# EAGLE schematic CC2530EV (EAGLE 7.1.0)
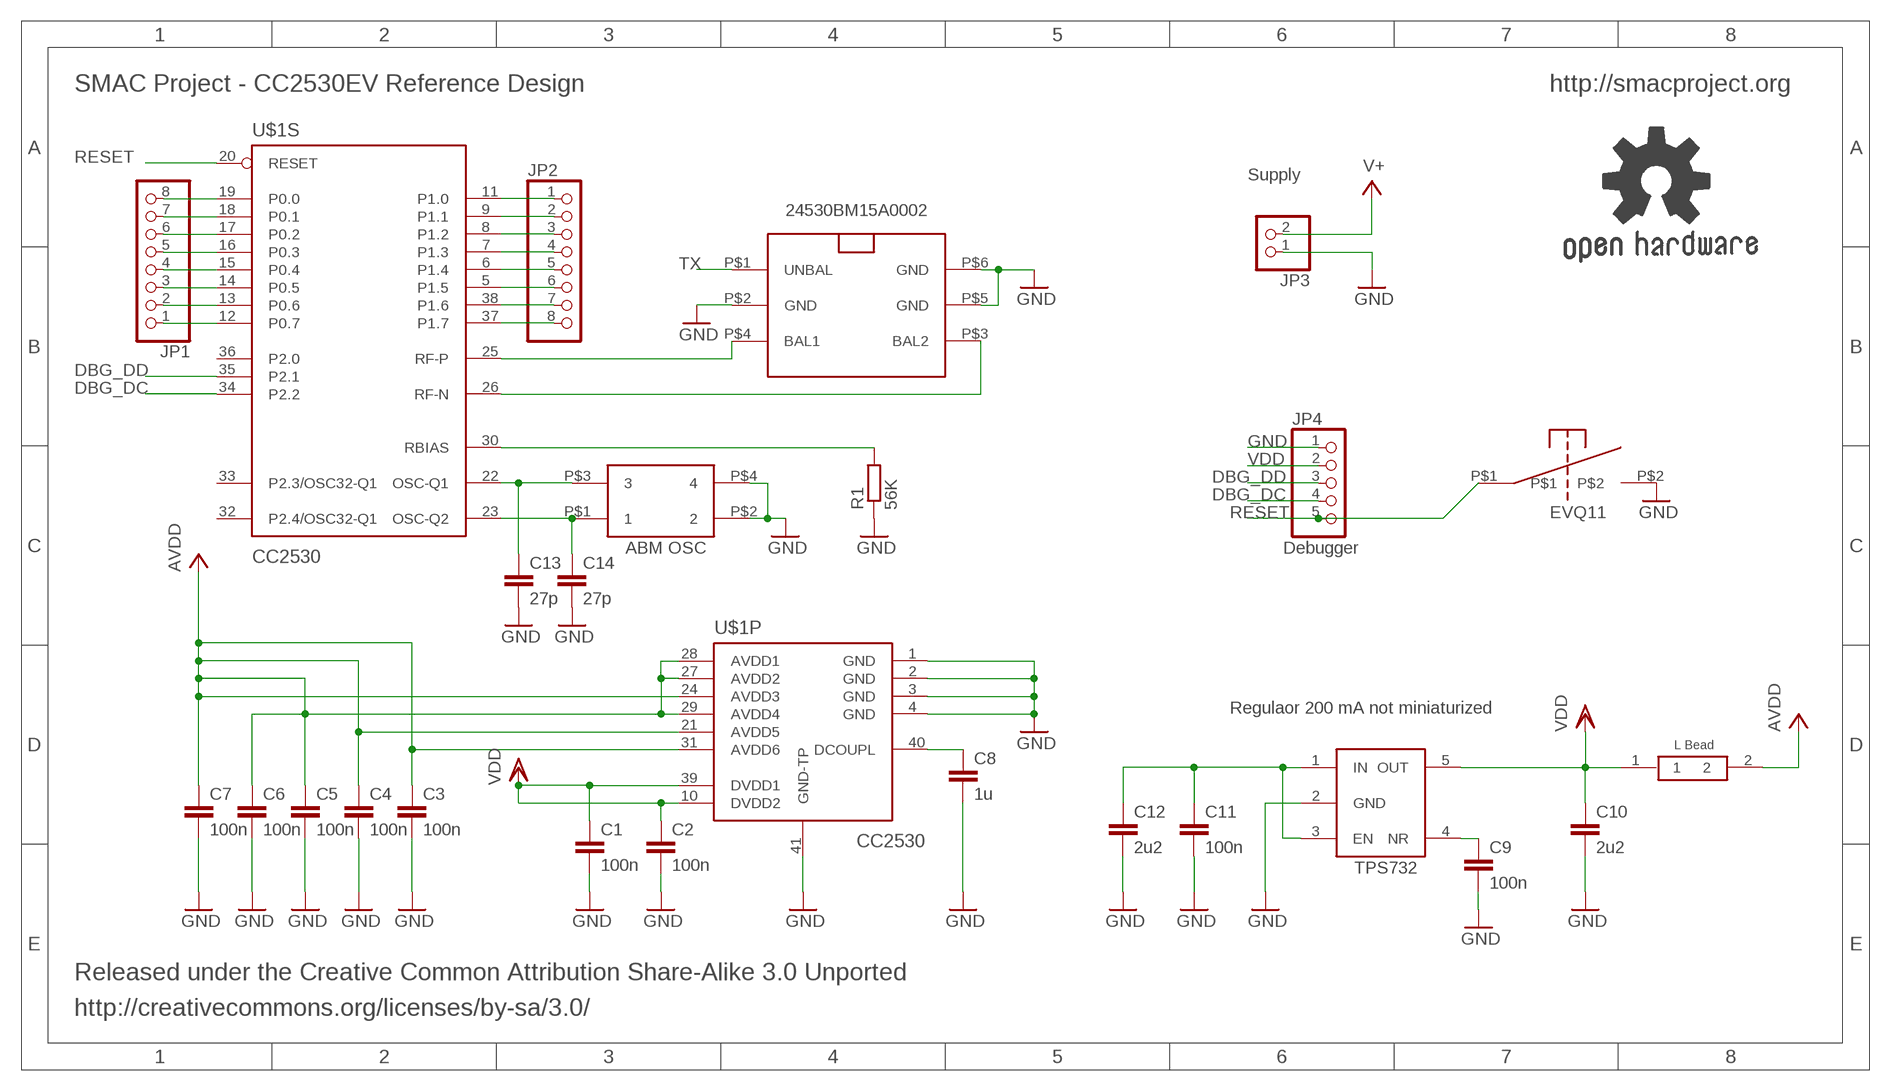
[diagram p0: schematic, sheet 1]

## Parts
C1  100n  C-EUC0402  [C0402]
C2  100n  C-EUC0402  [C0402]
C3  100n  C-EUC0402  [C0402]
C4  100n  C-EUC0402  [C0402]
C5  100n  C-EUC0402  [C0402]
C6  100n  C-EUC0402  [C0402]
C7  100n  C-EUC0402  [C0402]
C8  1u  C-EUC0402  [C0402]
C9  100n  C-EUC0402  [C0402]
C10  2u2  C-EUC0402  [C0402]
C11  100n  C-EUC0402  [C0402]
C12  2u2  C-EUC0402  [C0402]
C13  27p  C-EUC0402  [C0402]
C14  27p  C-EUC0402  [C0402]
GOLD_ORB_SM1  OSHWLOGO_GOLD_ORB_SM  [OSHW2]
JP1  PINHD-1X8  [1X08]
JP2  PINHD-1X8  [1X08]
JP3  PINHD-1X2  [1X02]
JP4  PINHD-1X5  [1X05]
L-BEAD  L-BEAD  [L-BEAD]
R1  56K  R-EU_R0402  [R0402]
U$1  CC2530  [QFN50P600X600X100-41N]
U$2  24530BM15A0002  [24530BM15A0002]
U$3  TPS732XX  [SOT23]
U$4  XTAL32M  [2.5X2X0.5]
U$5  PUSH_BOT  [EVQ_11_TH]

## Nets
DBG_DC: JP4.4 U$1.34(P2.2)
DBG_DD: JP4.3 U$1.35(P2.1)
GND: C1.2 C2.2 C3.2 C4.2 C5.2 C6.2 C7.2 C8.2 C9.2 C10.2 C11.2 C12.2 C13.2 C14.2 JP3.1 JP4.1 R1.1 U$1.1(GND) U$1.2(GND) U$1.3(GND) U$1.4(GND) U$1.41(GND-TP) U$2.P$2(GND) U$2.P$5(GND) U$2.P$6(GND) U$3.2(GND) U$4.P$2 U$4.P$4 U$5.P$2
N$1: C8.1 U$1.40(DCOUPL)
N$2: R1.2 U$1.30(RBIAS)
N$3: U$1.25(RF-P) U$2.P$4(BAL1)
N$4: U$1.26(RF-N) U$2.P$3(BAL2)
N$6: C9.1 U$3.4(NR)
N$7: C14.1 U$1.23(OSC-Q2) U$4.P$1
N$8: C13.1 U$1.22(OSC-Q1) U$4.P$3
N$9: JP1.1 U$1.12(P0.7)
N$10: JP1.2 U$1.13(P0.6)
N$11: JP1.3 U$1.14(P0.5)
N$12: JP1.4 U$1.15(P0.4)
N$13: JP1.5 U$1.16(P0.3)
N$14: JP1.6 U$1.17(P0.2)
N$15: JP1.7 U$1.18(P0.1)
N$16: JP1.8 U$1.19(P0.0)
N$17: JP2.1 U$1.11(P1.0)
N$18: JP2.2 U$1.9(P1.1)
N$19: JP2.3 U$1.8(P1.2)
N$20: JP2.4 U$1.7(P1.3)
N$21: JP2.5 U$1.6(P1.4)
N$22: JP2.6 U$1.5(P1.5)
N$23: JP2.7 U$1.38(P1.6)
N$24: JP2.8 U$1.37(P1.7)
RESET: JP4.5 U$1.20(RESET) U$5.P$1
TX: U$2.P$1(UNBAL)
V+: C11.1 C12.1 JP3.2 U$3.1(IN) U$3.3(EN)
VCC: C3.1 C4.1 C5.1 C6.1 C7.1 L-BEAD.2 U$1.21(AVDD5) U$1.24(AVDD3) U$1.27(AVDD2) U$1.28(AVDD1) U$1.29(AVDD4) U$1.31(AVDD6) ; supply symbol labelled AVDD
VDD: C1.1 C2.1 C10.1 JP4.2 L-BEAD.1 U$1.10(DVDD2) U$1.39(DVDD1) U$3.5(OUT)
Unconnected: U$1.32(P2.4/OSC32-Q1) U$1.33(P2.3/OSC32-Q1) U$1.36(P2.0)

## Notes on the sheet
- SMAC Project - CC2530EV Reference Design | http://smacproject.org
- Supply
- Debugger
- Regulaor 200 mA not miniaturized
- Released under the Creative Common Attribution Share-Alike 3.0 Unported
- http://creativecommons.org/licenses/by-sa/3.0/

## Library data of the parts
C1-C14 = resistor:C-EU: CAPACITOR, European symbol
GOLD_ORB_SM1 = bfl:OSHWLOGO: These are Open-Source Hardware logos.
JP1 JP2 = pinhead:PINHD-1X8: PIN HEADER
JP3 = pinhead:PINHD-1X2: PIN HEADER
JP4 = pinhead:PINHD-1X5: PIN HEADER
L-BEAD = L-Bead:L-BEAD
R1 = resistor:R-EU_: RESISTOR, European symbol
U$1 = chipcon-ti-v2:CC2530: A True System-on-Chip Solution for 2.4-GHz IEEE 802.15.4 and ZigBee Applications
U$2 = 24530BM15A0002:24530BM15A0002
U$3 = TPS732xx:TPS732XX
U$4 = abm_osc:XTAL32M
U$5 = push_botton:PUSH_BOT